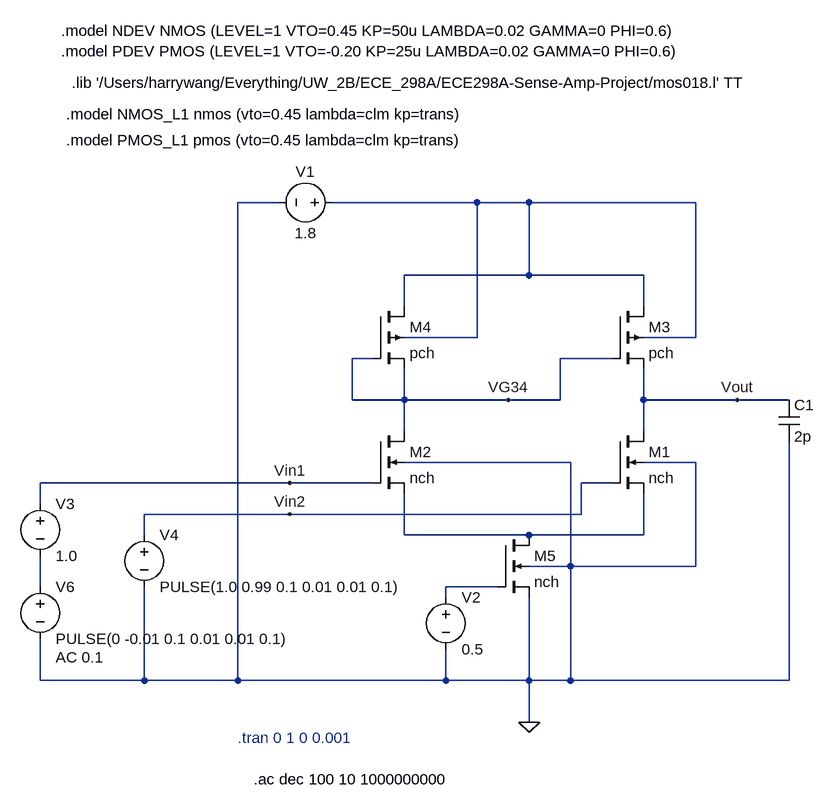
[diagram p0: schematic Sense_Amp.asc]
Sense_Amp.asc, the LTspice schematic file:
Version 4
SHEET 1 1660 680
WIRE -128 -256 -192 -256
WIRE 176 -256 -48 -256
WIRE 256 -256 176 -256
WIRE 512 -256 256 -256
WIRE 256 -144 256 -256
WIRE 256 -144 64 -144
WIRE 432 -144 256 -144
WIRE 64 -96 64 -144
WIRE 432 -96 432 -144
WIRE 176 -48 176 -256
WIRE 176 -48 64 -48
WIRE 512 -48 512 -256
WIRE 512 -48 432 -48
WIRE 16 -16 -16 -16
WIRE 384 -16 304 -16
WIRE -16 48 -16 -16
WIRE 64 48 64 0
WIRE 64 48 -16 48
WIRE 224 48 64 48
WIRE 304 48 304 -16
WIRE 304 48 224 48
WIRE 432 48 432 0
WIRE 576 48 432 48
WIRE 656 48 576 48
WIRE 64 96 64 48
WIRE 432 96 432 48
WIRE 320 144 64 144
WIRE 512 144 432 144
WIRE -112 176 -496 176
WIRE 16 176 -112 176
WIRE 384 176 336 176
WIRE -496 208 -496 176
WIRE -112 224 -336 224
WIRE 336 224 336 176
WIRE 336 224 -112 224
WIRE -336 256 -336 224
WIRE 64 256 64 192
WIRE 256 256 64 256
WIRE 432 256 432 192
WIRE 432 256 256 256
WIRE 320 304 320 144
WIRE 320 304 256 304
WIRE 512 304 512 144
WIRE 512 304 320 304
WIRE -496 336 -496 288
WIRE 208 336 128 336
WIRE 128 352 128 336
WIRE -496 480 -496 416
WIRE -336 480 -336 336
WIRE -336 480 -496 480
WIRE -192 480 -192 -256
WIRE -192 480 -336 480
WIRE 128 480 128 432
WIRE 128 480 -192 480
WIRE 256 480 256 352
WIRE 256 480 128 480
WIRE 320 480 320 304
WIRE 320 480 256 480
WIRE 656 480 656 112
WIRE 656 480 320 480
WIRE 256 544 256 480
FLAG 256 544 0
FLAG 576 48 Vout
FLAG -112 176 Vin1
FLAG -112 224 Vin2
FLAG 224 48 VG34
SYMBOL voltage -32 -256 R90
WINDOW 0 -32 56 VBottom 2
WINDOW 3 32 56 VTop 2
WINDOW 123 0 0 Left 0
WINDOW 39 0 0 Left 0
SYMATTR InstName V1
SYMATTR Value 1.8
SYMBOL voltage 128 336 R0
WINDOW 123 0 0 Left 0
WINDOW 39 0 0 Left 0
SYMATTR InstName V2
SYMATTR Value 0.5
SYMBOL voltage -496 192 R0
WINDOW 123 0 0 Left 0
WINDOW 39 0 0 Left 0
SYMATTR Value 1.0
SYMATTR InstName V3
SYMBOL voltage -336 240 R0
WINDOW 123 0 0 Left 0
WINDOW 39 0 0 Left 0
SYMATTR Value PULSE(1.0 0.99 0.1 0.01 0.01 0.1)
SYMATTR InstName V4
SYMBOL voltage -496 320 R0
WINDOW 123 24 124 Left 2
WINDOW 39 0 0 Left 0
SYMATTR Value2 AC 0.1
SYMATTR InstName V6
SYMATTR Value PULSE(0 -0.01 0.1 0.01 0.01 0.1)
SYMBOL cap 640 48 R0
SYMATTR InstName C1
SYMATTR Value 2p
SYMBOL pmos4 384 -96 R0
SYMATTR InstName M3
SYMATTR Value pch
SYMATTR Value2 l=0.25e-6 w=15e-6
SYMBOL pmos4 16 -96 R0
SYMATTR InstName M4
SYMATTR Value pch
SYMATTR Value2 l=0.25e-6 w=15e-6
SYMBOL nmos4 384 96 R0
SYMATTR InstName M1
SYMATTR Value nch
SYMATTR Value2 l=0.25e-6 w=15e-6
SYMBOL nmos4 16 96 R0
SYMATTR InstName M2
SYMATTR Value nch
SYMATTR Value2 l=0.25e-6 w=15e-6
SYMBOL nmos4 208 256 R0
SYMATTR InstName M5
SYMATTR Value nch
SYMATTR Value2 l=0.25e-6 w=15e-6
TEXT -192 568 Left 2 ;.tran 0 1 0 0.001
TEXT -464 -520 Left 2 !.model NDEV NMOS (LEVEL=1 VTO=0.45 KP=50u LAMBDA=0.02 GAMMA=0 PHI=0.6)\n.model PDEV PMOS (LEVEL=1 VTO=-0.20 KP=25u LAMBDA=0.02 GAMMA=0 PHI=0.6)
TEXT -168 632 Left 2 !.ac dec 100 10 1000000000
TEXT -448 -440 Left 2 !.lib '/Users/harrywang/Everything/UW_2B/ECE_298A/ECE298A-Sense-Amp-Project/mos018.l' TT
TEXT -456 -392 Left 2 !.model NMOS_L1 nmos (vto=0.45 lambda=clm kp=trans)
TEXT -456 -352 Left 2 !.model PMOS_L1 pmos (vto=0.45 lambda=clm kp=trans)

The netlist it stands for:
* Sense_Amp.asc
V1 N001 0 1.8
V2 N004 0 0.5
V3 Vin1 N003 1.0
V4 Vin2 0 PULSE(1.0 0.99 0.1 0.01 0.01 0.1)
V6 N003 0 PULSE(0 -0.01 0.1 0.01 0.01 0.1) AC 0.1
C1 Vout 0 2p
M3 N001 VG34 Vout N001 pch l=0.25e-6 w=15e-6
M4 N001 VG34 VG34 N001 pch l=0.25e-6 w=15e-6
M1 Vout Vin2 N002 0 nch l=0.25e-6 w=15e-6
M2 VG34 Vin1 N002 0 nch l=0.25e-6 w=15e-6
M5 N002 N004 0 0 nch l=0.25e-6 w=15e-6
.model NMOS NMOS
.model PMOS PMOS
.lib standard.mos
* .tran 0 1 0 0.001
.model NDEV NMOS (LEVEL=1 VTO=0.45 KP=50u LAMBDA=0.02 GAMMA=0 PHI=0.6)
.model PDEV PMOS (LEVEL=1 VTO=-0.20 KP=25u LAMBDA=0.02 GAMMA=0 PHI=0.6)
.ac dec 100 10 1000000000
.lib '/Users/harrywang/Everything/UW_2B/ECE_298A/ECE298A-Sense-Amp-Project/mos018.l' TT
.model NMOS_L1 nmos (vto=0.45 lambda=clm kp=trans)
.model PMOS_L1 pmos (vto=0.45 lambda=clm kp=trans)
.backanno
.end